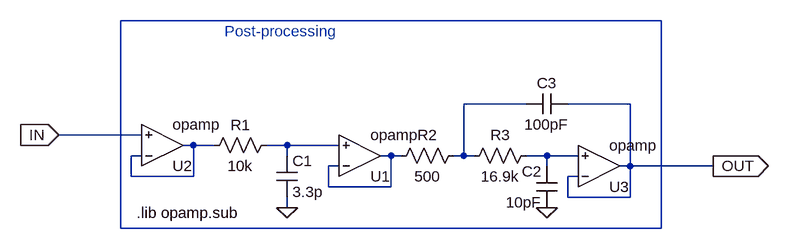
[diagram p0: schematic Post-Filter.asc]
Post-Filter.asc, the LTspice schematic file:
Version 4
SHEET 1 880 680
WIRE 560 -48 -272 -48
WIRE 352 80 256 80
WIRE 512 80 416 80
WIRE -240 128 -368 128
WIRE -160 144 -176 144
WIRE -128 144 -160 144
WIRE -16 144 -48 144
WIRE 64 144 -16 144
WIRE -240 160 -256 160
WIRE -16 160 -16 144
WIRE 144 160 128 160
WIRE 160 160 144 160
WIRE 256 160 256 80
WIRE 256 160 240 160
WIRE 272 160 256 160
WIRE 384 160 352 160
WIRE 432 160 384 160
WIRE 64 176 48 176
WIRE 384 176 384 160
WIRE 512 176 512 80
WIRE 512 176 496 176
WIRE 640 176 512 176
WIRE -256 192 -256 160
WIRE -160 192 -160 144
WIRE -160 192 -256 192
WIRE 432 192 416 192
WIRE 48 208 48 176
WIRE 144 208 144 160
WIRE 144 208 48 208
WIRE 416 224 416 192
WIRE 512 224 512 176
WIRE 512 224 416 224
WIRE -16 240 -16 224
WIRE -272 272 -272 -48
WIRE 560 272 560 -48
WIRE 560 272 -272 272
FLAG -16 240 0
FLAG 384 240 0
FLAG -368 128 IN
IOPIN -368 128 In
FLAG 640 176 OUT
IOPIN 640 176 Out
SYMBOL Opamps\\opamp 96 224 M180
SYMATTR InstName U1
SYMATTR SpiceLine2 GBW=40Meg
SYMBOL res -32 128 R90
WINDOW 0 0 56 VBottom 2
WINDOW 3 32 56 VTop 2
SYMATTR InstName R1
SYMATTR Value 10k
SYMBOL cap -32 160 R0
SYMATTR InstName C1
SYMATTR Value 3.3p
SYMBOL Opamps\\opamp -208 208 M180
SYMATTR InstName U2
SYMATTR SpiceLine2 GBW=40Meg
SYMBOL Opamps\\opamp 464 240 M180
SYMATTR InstName U3
SYMATTR SpiceLine2 GBW=40Meg
SYMBOL res 256 144 R90
WINDOW 0 0 56 VBottom 2
WINDOW 3 32 56 VTop 2
SYMATTR InstName R2
SYMATTR Value 500
SYMBOL res 368 144 R90
WINDOW 0 0 56 VBottom 2
WINDOW 3 32 56 VTop 2
SYMATTR InstName R3
SYMATTR Value 16.9k
SYMBOL cap 400 240 R180
WINDOW 0 24 56 Left 2
WINDOW 3 24 8 Left 2
SYMATTR InstName C2
SYMATTR Value 10pF
SYMBOL cap 416 64 R90
WINDOW 0 0 32 VBottom 2
WINDOW 3 32 32 VTop 2
SYMATTR InstName C3
SYMATTR Value 100pF
TEXT -112 -32 Left 2 ;Post-processing
TEXT -248 248 Left 2 !.lib opamp.sub

The netlist it stands for:
* Post-Filter.asc
XU1 N005 N004 N005 opamp Aol=100K GBW=40Meg  ; pins invin noninvin out
R1 N004 N003 10k
C1 N004 0 3.3p
XU2 N003 IN N003 opamp Aol=100K GBW=40Meg  ; pins invin noninvin out
XU3 OUT N006 OUT opamp Aol=100K GBW=40Meg  ; pins invin noninvin out
R2 N002 N005 500
R3 N006 N002 16.9k
C2 0 N006 10pF
C3 OUT N002 100pF
* Post-processing
.lib opamp.sub
.backanno
.end